# EAGLE design nola4 (EAGLE 8.6.3)
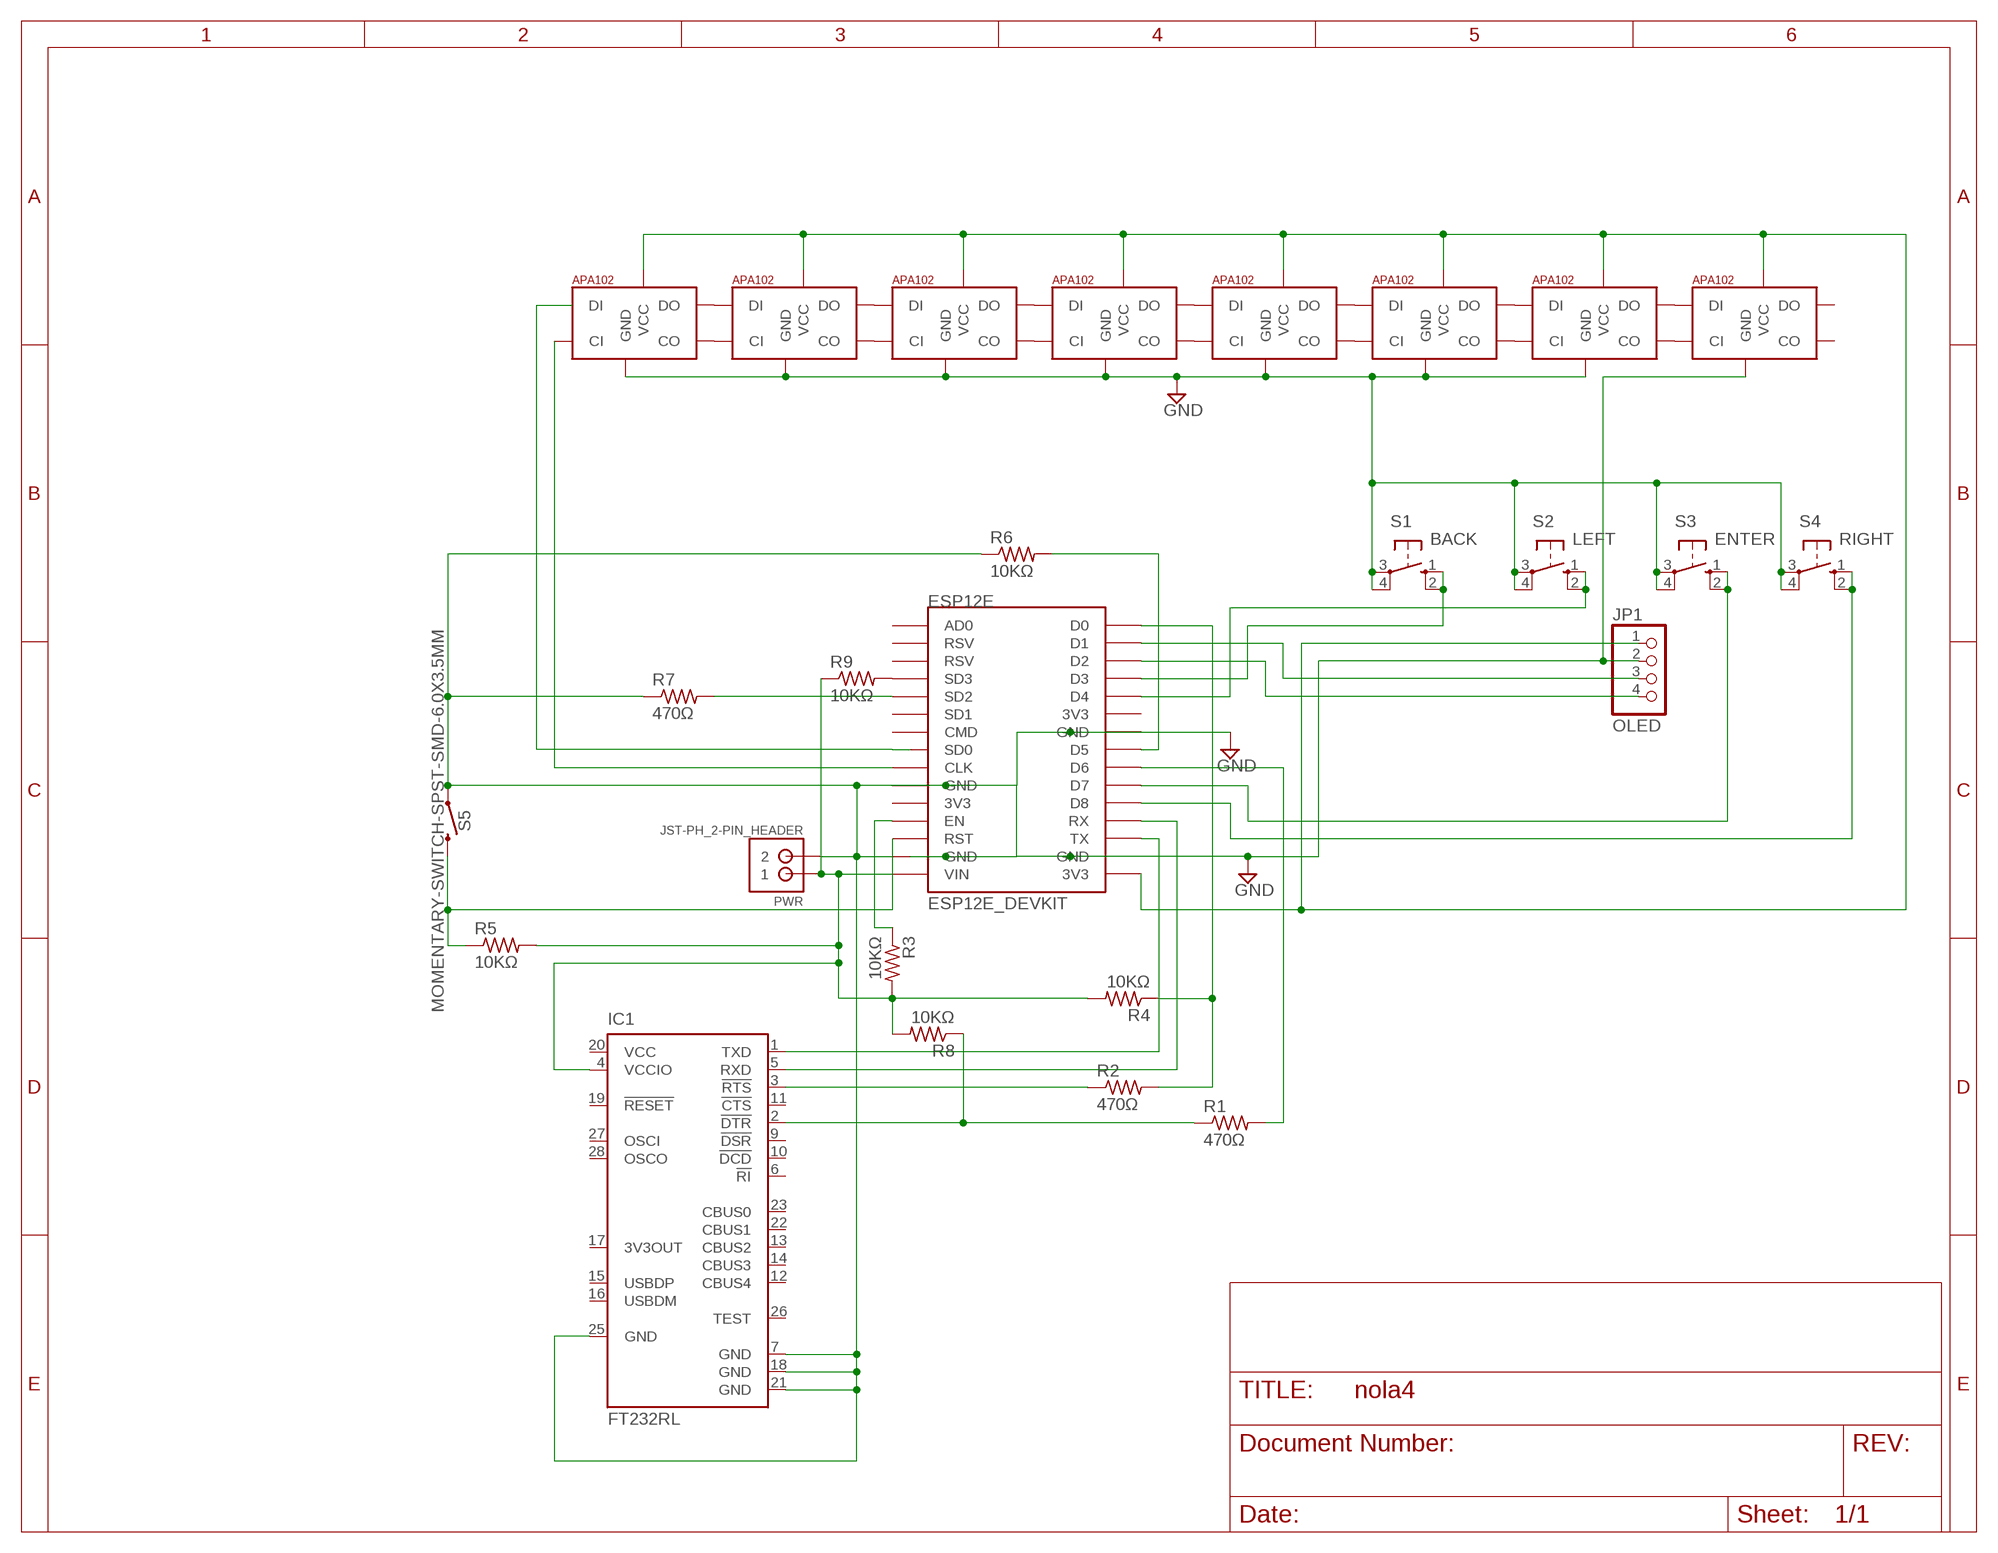
[diagram p0: schematic, sheet 1]

## Parts
ESP12E  ESP12E_DEVKIT  [ESP12E_DEVKIT]
IC1  FT232RL  [SSOP28]
JP1  OLED  PINHD-1X4  [1X04]
LED1  APA1025050  [APA102_5050]
LED2  APA1025050  [APA102_5050]
LED3  APA1025050  [APA102_5050]
LED4  APA1025050  [APA102_5050]
LED5  APA1025050  [APA102_5050]
LED6  APA1025050  [APA102_5050]
LED7  APA1025050  [APA102_5050]
LED8  APA1025050  [APA102_5050]
PWR  JST-PH_2-PIN_HEADER  [JST_B2B-PH_HEADER]
R1  470Ω  R-US_R0805  [R0805]
R2  470Ω  R-US_R0805  [R0805]
R3  10KΩ  R-US_R0805  [R0805]
R4  10KΩ  R-US_R0805  [R0805]
R5  10KΩ  R-US_R0805  [R0805]
R6  10KΩ  R-US_R0805  [R0805]
R7  470Ω  R-US_R0805  [R0805]
R8  10KΩ  R-US_R0805  [R0805]
R9  10KΩ  R-US_R0805  [R0805]
S1  BACK  10-XX  [B3F-10XX]
S2  LEFT  10-XX  [B3F-10XX]
S3  ENTER  10-XX  [B3F-10XX]
S4  RIGHT  10-XX  [B3F-10XX]
S5  MOMENTARY-SWITCH-SPST-SMD-6.0X3.5MM  [TACTILE_SWITCH_SMD_6.0X3.5MM]

## Nets
GND: ESP12E.GND@0(GND) ESP12E.GND@1(GND) ESP12E.GND@2(GND) ESP12E.GND@3(GND) IC1.7(GND) IC1.18(GND) IC1.21(GND) IC1.25(GND) JP1.2 LED1.6(GND) LED2.6(GND) LED3.6(GND) LED4.6(GND) LED5.6(GND) LED6.6(GND) LED7.6(GND) LED8.6(GND) PWR.P2 R6.1 R7.1 S1.3(P) S1.4(P1) S2.3(P) S2.4(P1) S3.3(P) S3.4(P1) S4.3(P) S4.4(P1) S5.1
N$1: LED1.3(DO) LED2.4(DI)
N$2: LED1.2(CO) LED2.5(CI)
N$3: LED2.3(DO) LED3.4(DI)
N$4: LED2.2(CO) LED3.5(CI)
N$5: LED3.3(DO) LED4.4(DI)
N$6: LED3.2(CO) LED4.5(CI)
N$7: LED4.3(DO) LED5.4(DI)
N$8: LED4.2(CO) LED5.5(CI)
N$9: LED5.3(DO) LED6.4(DI)
N$10: LED5.2(CO) LED6.5(CI)
N$11: LED6.3(DO) LED7.4(DI)
N$12: LED6.2(CO) LED7.5(CI)
N$13: LED7.3(DO) LED8.4(DI)
N$14: LED7.2(CO) LED8.5(CI)
N$15: ESP12E.D1 JP1.3
N$16: ESP12E.3V3@2(3V3) JP1.1 LED1.1(VCC) LED2.1(VCC) LED3.1(VCC) LED4.1(VCC) LED5.1(VCC) LED6.1(VCC) LED7.1(VCC) LED8.1(VCC)
N$17: ESP12E.D2 JP1.4
N$18: ESP12E.D0 ESP12E.TX IC1.1(TXD) R2.2 R4.1
N$19: ESP12E.SD0 LED1.4(DI)
N$20: ESP12E.CLK LED1.5(CI)
N$22: ESP12E.D3 S1.1(S) S1.2(S1)
N$23: ESP12E.D4 S2.1(S) S2.2(S1)
N$24: ESP12E.D7 S3.1(S) S3.2(S1)
N$25: ESP12E.D8 S4.1(S) S4.2(S1)
N$26: ESP12E.EN R3.1
N$28: ESP12E.RX IC1.5(RXD)
N$29: ESP12E.RST R5.1 S5.2
N$30: IC1.3(!RTS) R2.1
N$31: ESP12E.D6 R1.2
N$32: IC1.2(!DTR) R1.1 R8.1
N$33: ESP12E.VIN IC1.4(VCCIO) PWR.P1 R3.2 R4.2 R5.2 R8.2 R9.1
N$34: ESP12E.SD2 R7.2
N$35: ESP12E.D5 R6.2
N$36: ESP12E.SD3 R9.2
Unconnected: ESP12E.3V3@0(3V3) ESP12E.3V3@1(3V3) ESP12E.AD0 ESP12E.CMD ESP12E.RSV@0(RSV) ESP12E.RSV@1(RSV) ESP12E.SD1 IC1.6(!RI) IC1.9(!DSR) IC1.10(!DCD) IC1.11(!CTS) IC1.12(CBUS4) IC1.13(CBUS2) IC1.14(CBUS3) IC1.15(USBDP) IC1.16(USBDM) IC1.17(3V3OUT) IC1.19(!RESET) IC1.22(CBUS1) IC1.23(CBUS0) IC1.26(TEST) IC1.27(OSCI) IC1.28(OSCO) LED8.2(CO) LED8.3(DO)

## Power pins joined to a net without a drawn wire
VCC: IC1.20(VCC)

## Library data of the parts
ESP12E = ESP12E_DEVKIT:ESP12E_DEVKIT: ESP12E DEVKIT BOARD
IC1 = ftdichip:FT232R: Source: http://www.ftdichip.com/Documents/DataSheets/DS_FT232R_v104.pdf; MPN: FT232RL; OC_FARNELL: 1146032; OC_NEWARK: 91K9918
JP1 = pinhead:PINHD-1X4: PIN HEADER
LED1-LED8 = jos-ph:APA102: APA102C 5050 RGB LED -- Adafruit DotStar Single LED Pixel Product Page: https://www.adafruit.com/products/2343 Datasheet: https://cdn-shop.adafruit.com/product-files/2343/APA102C.pdf
PWR = SRG:JST-PH_2-PIN_HEADER: 2-pin JST PH Shrouded Header, top entry P/N B2B-PH-K-S Mating connector PHR-2 Mating cable assembly: Sparkfun PRT-09914
R1-R9 = rcl:R-US_: RESISTOR, American symbol; SPICEPREFIX: R
S1-S4 = switch-omron:10-XX: OMRON SWITCH; MPN: B3F-1000; OC_FARNELL: 176432; OC_NEWARK: 36M3542
S5 = SparkFun-Switches:MOMENTARY-SWITCH-SPST: Momentary Switch (Pushbutton) - SPST Normally-open (NO) SPST momentary switches (buttons, pushbuttons). Variants PTH-12MM - 12mm square, through-hole Momentary Pushbutton Switch - 12mm Square (COM-09190) PTH-6.0MM, PTH-6.0MM-KIT - 6.0mm square, through-hole Mini Pushbutton Switch (COM-00097) KIT package intended for soldering kit's - only one side of pads' copper is exposed. PTH-RIGHT-ANGLE-KIT - Right-angle, through-hole Right Angle Tactile Button - Used on SparkFun BigTime Watch Kit SMD-12MM - 12mm square, surface-mount Tactile Button - SMD (12mm) (COM-12993) Used on SparkFun PicoBoard SMD-4.5MM - 4.5mm Square Trackball Switch Used on SparkFun Blackberry Trackballer Breakout SMD-4.6MMX2.8MM - 4.60mm x 2.80mm, surface mount Used on SparkFun SAMD21 Mini Breakout SMD-5.2MM, SMD-5.2-REDUNDANT - 5.2mm square, surface-mount Mini Pushbutton Switch - SMD (COM-08720) Used on Arduino Pro Mini REDUNDANT package connects both switch circuits together SMD-6.0X3.5MM - 6.0 x 3.5mm, surface mount Momentary Reset Switch SMD (COM-08229) SMD-6.2MM-TALL - 6.2mm square, surface mount Tactile Button - SMD (6mm) Used on SparkFun Digital Sandbox SMD-RIGHT-ANGLE - Right-angle, surface mount Used on SparkFun Block for Intel® Edison - Arduino; PROD_ID: SWCH-00815; SF_SKU: COM-08229

## Board
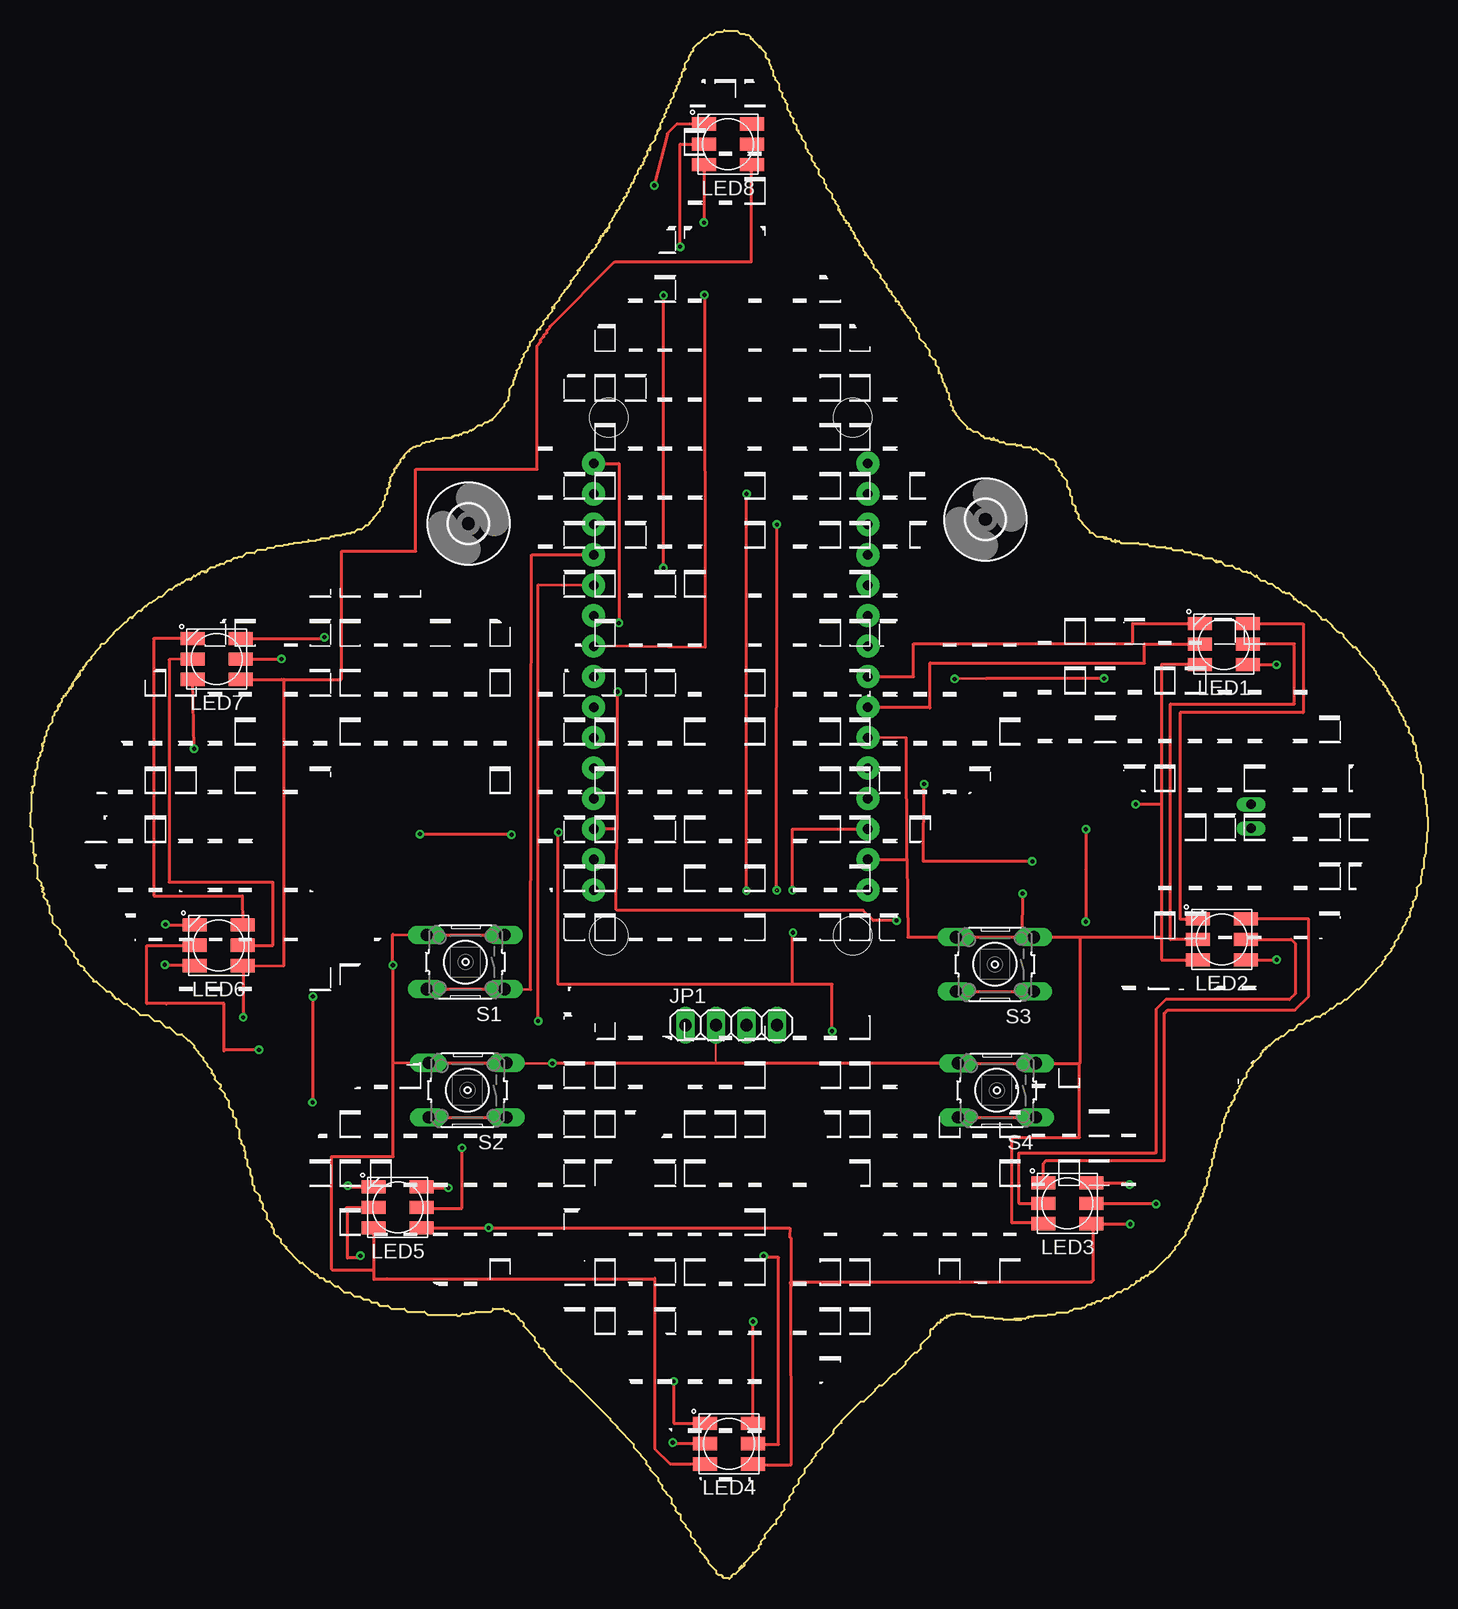
[diagram p1: board, top side]
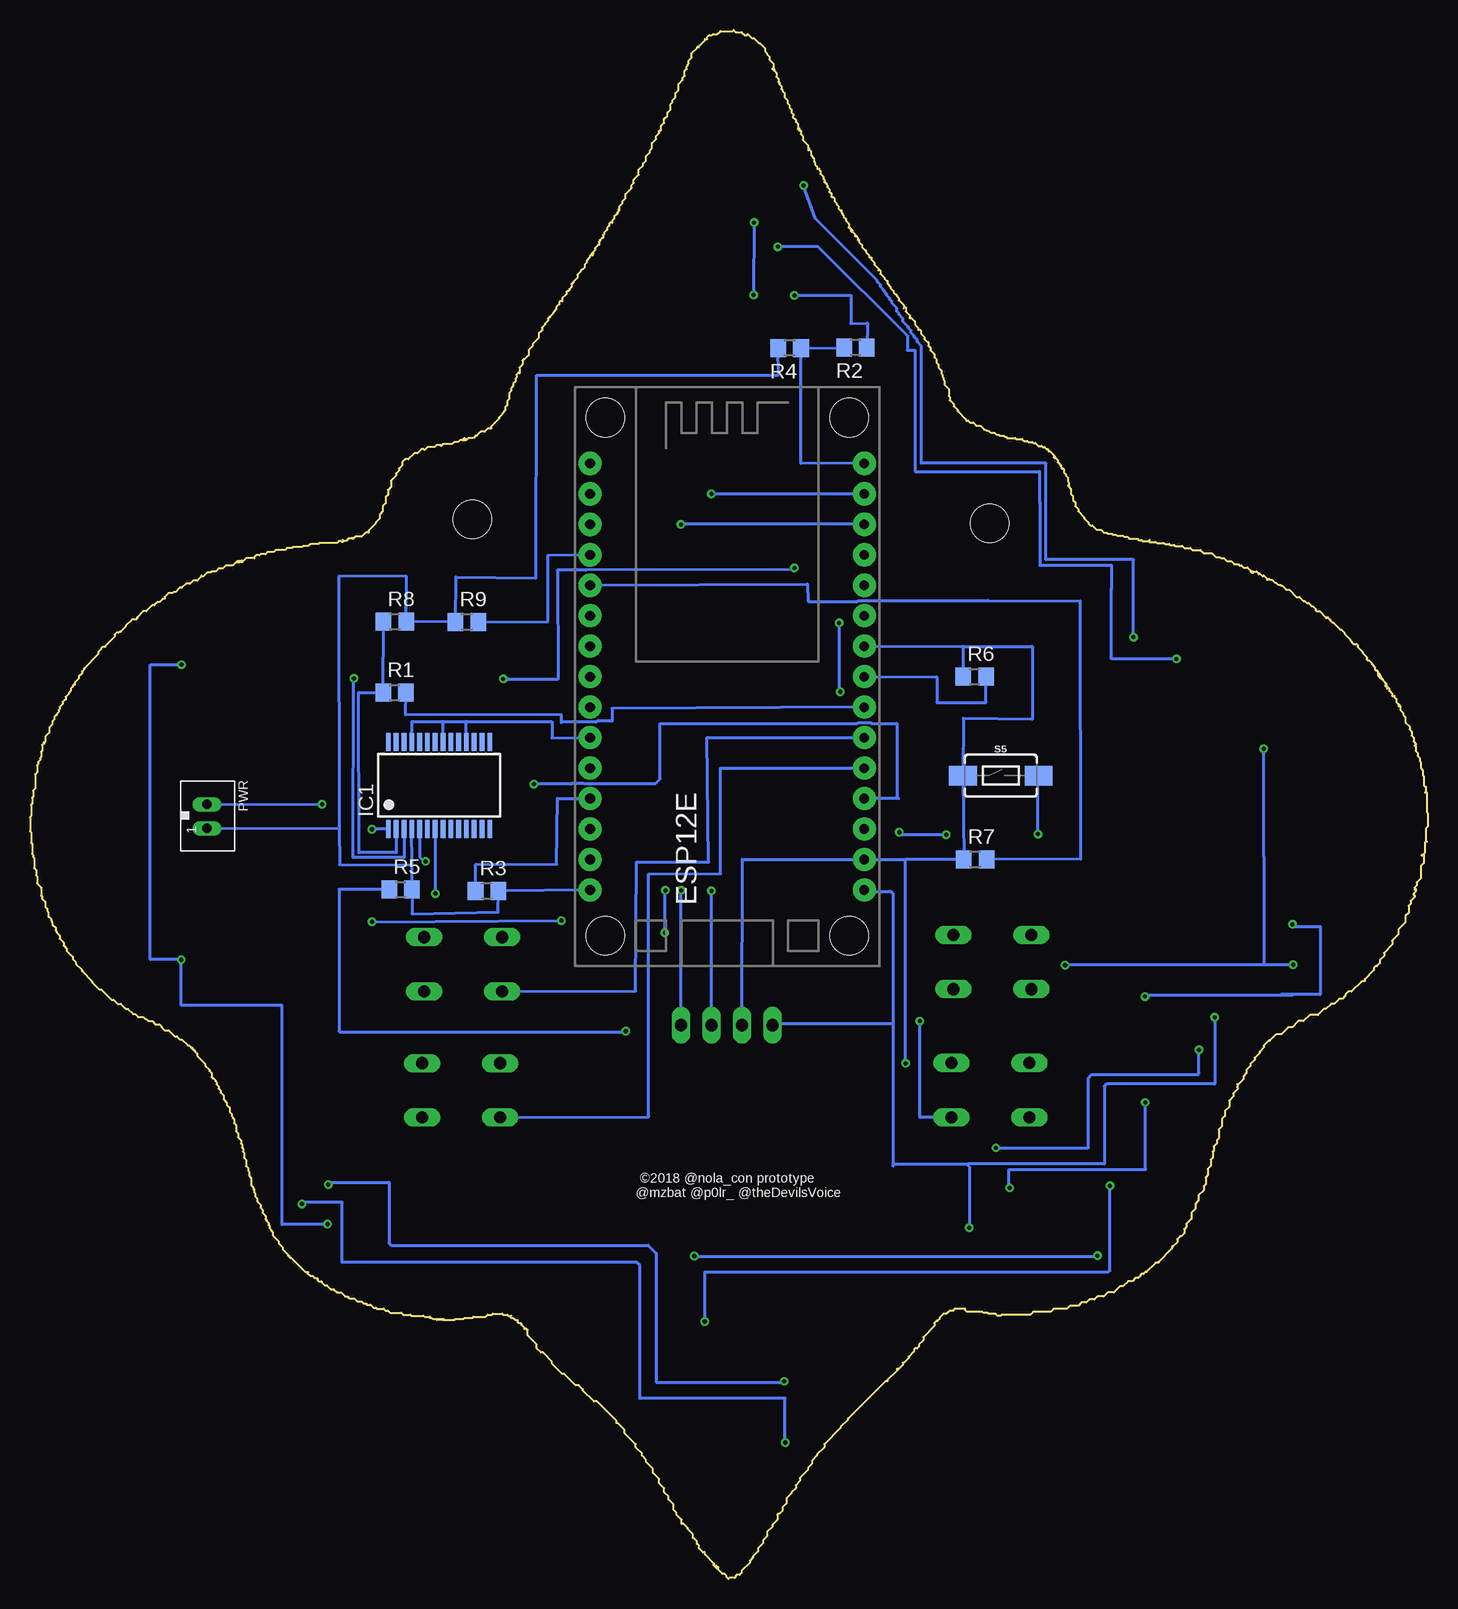
[diagram p2: board, bottom side, seen from below]

Size 116.53 x 129.12 mm. Coordinates in mm from the lower left corner, seen from the top.
Outline: 1364 segments
Copper layers (1*16): Top 0.0356mm / dielectric 1.5011mm / Bottom 0.0356mm
Design rules "osh": minimum track width 6mil, minimum drill 13mil, track to track 6mil, track to pad 6mil, pad to pad 6mil, via to via 6mil, smd to smd 6mil, copper to edge 15mil, drill to drill 6mil, minimum pad ring 7mil, minimum via ring 7mil, stop-mask expansion 4mil, vias tented up to drill 0mil, thermal gap 10mil

### Footprints (pad centres in the part's own frame; a part is rotated, then mirrored left to right if it is on the bottom)
ESP12E_DEVKIT = drill 0.8 pad 1.93: 3V3@0 -11.43,-7.62; 3V3@1 11.43,5.08; 3V3@2 11.43,-17.78; AD0 -11.43,17.78; CLK -11.43,-2.54; CMD -11.43,2.54; D0 11.43,17.78; D1 11.43,15.24; D2 11.43,12.7; D3 11.43,10.16; D4 11.43,7.62; D5 11.43,0; D6 11.43,-2.54; D7 11.43,-5.08; D8 11.43,-7.62; EN -11.43,-10.16; GND@0 -11.43,-5.08; GND@1 -11.43,-15.24; GND@2 11.43,2.54; GND@3 11.43,-15.24; RST -11.43,-12.7; RSV@0 -11.43,15.24; RSV@1 -11.43,12.7; RX 11.43,-10.16; SD0 -11.43,0; SD1 -11.43,5.08; SD2 -11.43,7.62; SD3 -11.43,10.16; TX 11.43,-12.7; VIN -11.43,-17.78 | hole 3.2: -10.16,21.59; 10.16,21.59; 10.16,-21.59; -10.16,-21.59
SSOP28 = smd 0.4 x 1.5: 1 -4.225,-3.625; 2 -3.575,-3.625; 3 -2.925,-3.625; 4 -2.275,-3.625; 5 -1.625,-3.625; 6 -0.975,-3.625; 7 -0.325,-3.625; 8 0.325,-3.625; 9 0.975,-3.625; 10 1.625,-3.625; 11 2.275,-3.625; 12 2.925,-3.625; 13 3.575,-3.625; 14 4.225,-3.625; 15 4.225,3.625; 16 3.575,3.625; 17 2.925,3.625; 18 2.275,3.625; 19 1.625,3.625; 20 0.975,3.625; 21 0.325,3.625; 22 -0.325,3.625; 23 -0.975,3.625; 24 -1.625,3.625; 25 -2.275,3.625; 26 -2.925,3.625; 27 -3.575,3.625; 28 -4.225,3.625
1X04 = drill 1.016 long: 1 -3.81,0; 2 -1.27,0; 3 1.27,0; 4 3.81,0
APA102_5050 = smd 2 x 1.1: 1 2,-1.7; 2 2,0; 3 2,1.7; 4 -2,1.7; 5 -2,0; 6 -2,-1.7
JST_B2B-PH_HEADER = drill 0.8 long: P1 1.075,0.048; P2 -0.925,0.048
R0805 = smd 1.3 x 1.5: 1 -0.95,0; 2 0.95,0
B3F-10XX = drill 1.016 long: 1 -3.251,2.261; 2 3.251,2.261; 3 -3.251,-2.261; 4 3.251,-2.261
TACTILE_SWITCH_SMD_6.0X3.5MM = smd 2.3 x 1.6: 1 -3.15,0; 2 3.15,0
3,2 = hole 3.2: 0,0

### Placement (x,y rotation side)
ESP12E  58.41,75.21 0 bottom
IC1  82.43,66.15 0 bottom
JP1  58.45,46.15 0 top
LED1  99.53,77.93 0 top
LED2  99.34,53.31 0 top
LED3  86.49,31.31 0 top
LED4  58.27,11.28 0 top
LED5  30.67,30.97 0 top
LED6  15.72,52.82 0 top
LED7  15.57,76.69 0 top
LED8  58.18,119.59 0 top
PWR  101.84,63.64 270 bottom
R1  86.14,73.89 0 bottom
R2  47.72,102.64 180 bottom
R3  78.44,57.36 0 bottom
R4  53.22,102.59 180 bottom
R5  85.64,57.48 0 bottom
R6  37.78,75.22 0 bottom
R7  37.75,59.98 0 bottom
R8  86.11,79.79 0 bottom
R9  80.11,79.78 0 bottom
S1  36.3,51.42 180 top
S2  36.47,40.74 180 top
S3  80.44,51.23 180 top
S4  80.59,40.73 180 top
S5  35.61,66.96 0 bottom
U$1  [3,2]  36.55,87.97 0 top
U$2  [3,2]  79.65,88.31 0 top

### Tracks (layer width: path | path; a pad name or v marks a point on that pad's centre or on a via)
GND  (via drill 0.35)
  Top 0.152: 57.24,42.99 57.2,43.03 57.2,46.13
  Top 0.254: 30.25,42.95 v30.25,51.16 30.25,53.73 S1.4 S1.3 | 30.25,42.95 30.25,35.2 30.27,35.18 25.13,35.18 25.13,25.81 25.21,25.73 28.67,25.73 | LED1.6 94.32,76.23 94.32,64.58 | LED2.6 94.32,51.61 94.32,53.49 | 94.32,64.58 94.32,53.49 | 87.52,53.49 94.32,53.49 | 87.52,53.49 87.52,42.99 87.47,42.99 | LED3.6 84.44,29.66 81.86,29.66 81.86,36.49 81.75,36.6 81.93,36.78 87.49,36.78 87.49,42.97 87.47,42.99 | 29.75,25.02 29.76,25.02 | 29.76,25.02 52.04,25.02 52.08,25.06 52.08,10.86 53.36,9.58 LED4.6 | LED5.6 28.67,25.73 | 28.67,25.73 28.67,24.98 28.68,24.97 28.73,25.02 29.76,25.02 | LED6.6 11.23,51.12 v11.23,51.19 | v13.69,69.2 LED7.6 | 43.55,42.99 57.24,42.99 S4.4 S4.3 87.47,42.99 | 43.55,42.99 v43.54,42.97 | 82.69,53.49 S3.4 73.17,53.5 73.12,59.97 | 82.69,53.49 S3.3 87.52,53.49 | 43.55,42.99 S2.3 S2.4 30.25,42.95 | LED8.6 v56.18,113.06 | ESP12E.GND@1 73.12,59.97 | 73.12,59.97 73.04,70.1 ESP12E.GND@0 | v92.18,64.58 94.32,64.58 | v56.22,107.04 56.28,77.64 ESP12E.GND@2 | v82.75,57.13 82.69,53.49
  Bottom 0.254: 43.51,59.99 ESP12E.GND@3 57.14,59.98 JP1.2 | v11.23,51.19 13.65,51.19 | 13.65,51.19 30.25,51.19 v30.25,51.16 | 13.65,51.19 v13.69,69.2 | v43.54,42.97 43.54,59.96 43.51,59.99 | 43.51,59.99 R7.1 S5.1 38.73,71.72 32.99,71.65 32.99,77.73 38.73,77.74 | ESP12E.GND@2 38.73,77.74 | R6.1 38.73,77.74 | IC1.18 80.18,71.47 | 80.18,71.47 73.03,71.47 73.02,70.09 ESP12E.GND@0 | PWR.P2 v92.18,64.58 | v56.18,113.06 v56.22,107.04 | IC1.21 82.11,71.47 | 82.11,71.47 80.18,71.47 | IC1.25 84.68,71.47 82.11,71.47 | IC1.7 v82.75,57.13
N$1
  Top 0.254: LED1.3 106.13,79.63 106.13,72.21 95.87,72.21 95.87,55.01 LED2.4
N$2
  Top 0.254: LED2.5 95.08,53.31 | 95.08,53.31 95.08,53.28 | 95.08,53.31 95.08,72.94 105.42,72.94 105.42,77.93 | 105.42,77.93 | 105.42,77.93 LED1.2
N$3
  Top 0.254: LED3.4 84.49,34.66 84.7,34.87 94.55,34.87 94.55,47.15 94.82,47.42 105.45,47.42 106.59,48.56 106.59,54.99 101.36,54.99 LED2.3
N$4
  Top 0.254: LED2.2 105.13,53.31 105.46,52.98 105.46,48.77 104.99,48.3 94.68,48.3 93.86,47.48 93.86,35.55 93.8,35.48 82.4,35.48 82.4,31.35 82.45,31.29 82.47,31.31 LED3.5
N$5  (via drill 0.35)
  Top 0.254: LED3.3 91.53,33.01 v91.67,32.87 | v53.66,16.47 53.66,12.98 LED4.4
  Bottom 0.254: v91.67,32.87 91.48,33.06 86.61,33.06 86.61,28 86.42,27.81 64.99,27.81 64.33,27.14 64.33,16.39 53.73,16.39 v53.66,16.47
N$6  (via drill 0.35)
  Top 0.254: LED4.5 53.67,11.28 v53.58,11.37 | v93.87,31.26 88.54,31.26 LED3.2
  Bottom 0.254: v53.58,11.37 53.58,15.06 65.66,15.06 65.7,15.02 65.7,26.16 65.94,26.39 90.46,26.39 90.5,26.36 90.5,31.38 93.75,31.38 v93.87,31.26
N$7  (via drill 0.35)
  Top 0.254: LED4.3 60.27,21.43 v60.28,21.44 | v26.51,32.77 26.61,32.67 LED5.4
  Bottom 0.254: v60.28,21.44 60.28,25.58 26.64,25.58 26.51,25.71 v26.51,32.77
N$8  (via drill 0.35)
  Top 0.254: LED4.2 60.33,11.22 62.4,11.22 62.4,26.78 62.36,26.81 61.25,26.81 v61.15,26.91 | v27.55,26.94 27.35,26.74 26.47,26.74 26.47,30.86 26.37,30.96 LED5.5
  Bottom 0.254: v61.15,26.91 27.58,26.91 v27.55,26.94
N$9  (via drill 0.35)
  Top 0.254: LED5.3 32.74,32.59 v34.87,32.59 | v23.56,39.72 arc90 23.59,39.75 v23.59,48.55 | v11.3,54.56 arc90 11.34,54.52 LED6.4
  Bottom 0.254: v34.87,32.59 arc90 34.91,32.63 34.91,34.11 arc90 34.89,34.13 23.53,34.13 arc90 23.56,34.16 v23.56,39.72 | v23.59,48.55 arc90 23.46,48.68 12.25,48.68 | 12.25,48.68 11.3,48.68 | v11.3,54.56 11.3,54.4 8.98,54.4 8.98,48.71 12.25,48.71 12.25,48.68
N$10  (via drill 0.35)
  Top 0.254: LED5.2 32.74,30.89 36.01,30.89 v36.01,35.93 | v19.08,44.1 16.27,44.1 16.17,44 16.17,47.96 11.4,47.96 | 11.4,47.96 11.36,47.92 | 11.4,47.96 9.73,47.96 9.73,52.79 13.7,52.79 LED6.5
  Bottom 0.254: v36.01,35.93 28.33,35.93 28.3,35.96 28.3,41.78 28.04,42.04 19.18,42.04 19.08,42.14 v19.08,44.1
N$11
  Top 0.254: LED7.4 10.3,78.38 10.32,56.95 17.71,56.94 LED6.3
N$12
  Top 0.254: LED7.5 11.6,76.63 11.6,58.08 20.26,58.08 20.26,52.81 LED6.2
N$13  (via drill 0.35)
  Top 0.254: LED7.3 24.55,78.39 v24.55,78.51 | v52.05,116.15 53.18,120.47 53.11,120.47 53.93,121.29 LED8.4
  Bottom 0.254: v24.55,78.51 24.55,84.96 31.84,84.96 31.84,93 42.24,93 42.24,102.78 42.57,103.12 42.57,103.29 42.83,103.54 42.83,103.63 43.08,103.88 43.08,104.05 43.34,104.31 43.34,104.39 43.76,104.82 43.76,105.07 44.1,105.41 44.1,105.5 44.27,105.67 44.27,105.92 44.7,106.35 44.7,106.52 44.87,106.69 44.87,106.77 45.12,107.03 45.12,107.11 45.38,107.37 45.38,107.45 45.63,107.71 45.63,107.88 45.89,108.13 45.89,108.22 51.04,113.36 v52.05,116.15
N$14  (via drill 0.35)
  Top 0.254: LED7.2 v20.97,76.69 | v54.19,111.05 54.19,119.6 56.18,119.6 LED8.5
  Bottom 0.254: v20.97,76.69 26.38,76.69 26.38,82.47 26.38,82.61 26.38,84.5 32.36,84.5 32.36,89.71 32.38,89.73 32.38,92.31 42.76,92.31 42.76,102.42 43.4,102.42 43.4,103.63 50.83,111.05 v54.19,111.05
N$15  (via drill 0.35)
  Top 0.254: v59.73,57.35 v59.73,90.45
  Bottom 0.254: JP1.3 v59.72,57.35 v59.73,57.35 | v59.73,90.45 ESP12E.D1
N$16  (via drill 0.35)
  Top 0.254: 101.34,51.68 LED2.1 v103.93,51.61 v103.93,51.62 | LED1.1 103.91,76.23 v103.91,76.22 | LED3.1 88.65,29.61 | 88.65,29.61 91.72,29.61 v91.72,29.57 | LED4.1 60.63,9.53 63.46,9.53 63.42,24.36 | 63.42,24.36 63.42,24.75 88.5,24.75 88.65,24.9 88.65,29.61 | LED5.1 v38.24,29.26 63.34,29.24 63.33,28.5 63.42,28.41 63.42,24.36 | v17.77,46.81 17.77,51.07 LED6.1 21.16,51.11 21.16,74.98 | LED7.1 20.96,74.98 21.16,74.98 | 21.16,74.98 25.98,74.98 25.98,85.68 32.16,85.68 32.16,92.51 42.28,92.51 42.28,102.82 42.57,103.12 42.57,103.29 42.83,103.54 42.83,103.63 43.08,103.88 43.08,104.05 43.34,104.31 43.34,104.39 48.74,109.79 60.13,109.79 60.13,117.89 LED8.1
  Bottom 0.152: 54.53,46.26 JP1.1
  Bottom 0.254: v103.91,76.22 106.51,76.22 106.51,51.62 v103.93,51.62 103.93,47.81 95.53,47.81 95.53,29.53 91.72,29.53 v91.72,29.57 | v17.77,46.81 17.77,41.26 26.8,41.26 26.99,41.06 26.99,34.59 38.34,34.59 | 38.34,34.59 38.4,34.52 38.24,34.36 v38.24,29.26 | ESP12E.3V3@2 arc-90 46.86,57.31 44.87,57.31 arc90 44.59,57.03 44.59,46.26 | 44.59,46.26 44.59,34.4 arc90 44.4,34.59 38.34,34.59 | 44.59,46.26 54.53,46.26
N$17  (via drill 0.35)  (1 unrouted)
  Top 0.254: 62.25,57.39 v62.27,87.9
  Bottom 0.254: JP1.4 arc90 JP1.4 v62.26,57.39 | ESP12E.D2 62.27,87.91 v62.27,87.9
N$18  (via drill 0.35)
  Top 0.254: v88.03,62.49 88.02,59.11 v88.02,54.78 | v72.23,54.88 70.29,54.88 69.45,55.73 48.96,55.73 48.87,55.81 48.94,62.5 | 48.94,62.5 ESP12E.TX | ESP12E.D0 49.09,92.99 v49.09,79.68 | v48.98,73.94 48.94,73.9 48.94,62.5
  Bottom 0.254: ESP12E.D0 52.27,93 R4.1 R2.2 | IC1.1 v88.03,62.49 | v88.02,54.78 72.23,54.87 v72.23,54.88 | v49.09,79.68 49.09,74.04 v48.98,73.94
N$19
  Top 0.254: ESP12E.SD0 73.28,75.21 73.28,75.2 73.65,75.2 73.65,77.97 91.93,77.97 91.93,79.65 98.3,79.65 98.3,79.63 | 98.3,79.42 98.3,79.63 | 98.3,79.63 LED1.4
N$20
  Top 0.254: ESP12E.CLK 74.99,72.67 74.99,72.61 75.02,72.61 75.02,76.36 92.91,76.33 92.91,77.94 LED1.5
N$22
  Top 0.254: S1.2 S1.1 41.74,49.13 41.81,85.37 ESP12E.D3
N$23  (via drill 0.35)
  Top 0.254: S2.2 S2.1 | v42.36,46.5 42.36,82.87 ESP12E.D4
  Bottom 0.254: S2.1 42.34,38.45 v42.36,46.5
N$24
  Top 0.254: S3.2 S3.1
  Bottom 0.254: S3.2 66.06,48.99 65.98,59.74 59.96,59.75 60.09,70.14 ESP12E.D7
N$25
  Top 0.254: S4.2 S4.1
  Bottom 0.254: S4.2 64.96,38.52 64.96,58.76 58.96,58.79 58.99,67.59 ESP12E.D8
N$26
  Bottom 0.254: R3.1 79.37,59.56 72.63,59.58 72.56,65.06 ESP12E.EN
N$28  (via drill 0.35)
  Top 0.254: v83.56,59.8 74.48,59.8 74.47,59.81 v74.54,66.26
  Bottom 0.254: IC1.5 84.05,60.19 83.67,59.8 v83.56,59.8 | ESP12E.RX 44.13,65.05 44.12,65.05 44.28,65.21 44.28,71.32 46.41,71.32 46.47,71.38 47.5,71.38 47.59,71.29 64.01,71.29 64.01,66.7 64.41,66.3 70.36,66.3 71.4,66.28 71.43,66.26 v74.54,66.26
N$29  (via drill 0.35)
  Top 0.254: v66.86,45.65 66.86,49.57 63.56,49.57 | 63.56,49.57 44.06,49.57 44.01,49.62 44.01,62.19 v44.06,62.24 | v40.14,62.03 32.56,62.03 v32.51,62.09 | 63.56,49.57 63.56,53.82 v63.6,53.86 | v63.56,57.39 63.56,62.48 63.54,62.5 ESP12E.RST
  Bottom 0.254: R5.1 90.78,57.48 90.78,57.47 90.78,45.65 90.73,45.6 66.91,45.6 v66.86,45.65 | v44.06,62.24 43.86,62.03 v40.14,62.03 | v32.51,62.09 32.51,66.91 S5.2 | v63.6,53.86 63.6,57.35 v63.56,57.39
N$30  (via drill 0.35)
  Top 0.254: v89.54,75.06 79.69,75.05 v77.09,75.02 | v52.81,84.27 v52.81,107
  Bottom 0.254: IC1.3 85.35,60.12 89.59,60.12 v89.54,75.06 | v77.09,75.02 72.5,75.03 72.57,84.08 70.22,84.08 52.93,84.15 v52.81,84.27 | v52.81,107 48.1,107 48.11,104.66 46.74,104.68 R2.1
N$31
  Bottom 0.254: ESP12E.D6 68.02,72.57 68.02,71.49 69.26,71.49 69.33,71.42 72.19,71.42 72.24,71.38 72.24,72.02 85.23,72.04 R1.2
N$32
  Bottom 0.254: IC1.2 86.01,60.54 89.1,60.54 89.12,73.9 R1.1 R8.1
N$33
  Bottom 0.254: ESP12E.VIN R3.2 77.5,55.58 84.68,55.43 R5.2 84.69,59.52 | 84.69,59.52 IC1.4 | 90.76,62.61 90.8,83.58 85.15,83.56 R8.2 R9.1 81.03,83.52 74.36,83.41 74.29,100.33 54.16,100.36 R4.2 | 90.76,62.61 90.74,59.53 84.69,59.52 | PWR.P1 90.76,62.61
N$34
  Bottom 0.254: ESP12E.SD2 51.73,82.93 51.67,81.49 47.55,81.49 47.5,81.53 36.67,81.53 36.65,81.55 29.01,81.52 28.95,59.99 R7.2
N$35
  Bottom 0.254: ESP12E.D5 40.94,75.18 40.94,73.07 36.84,73.07 R6.2
N$36
  Bottom 0.254: ESP12E.SD3 73.35,85.34 73.35,79.81 R9.2

### Text on the board
tPlace: /home/thedevilsvoice/workspace/badge_proto/nola/art/nola_eagle_layer21.bmp
bPlace: ©2018 @nola_con prototype / @mzbat @p0lr_ @theDevilsVoice